# EAGLE design drucksensor (EAGLE 6.6.0)
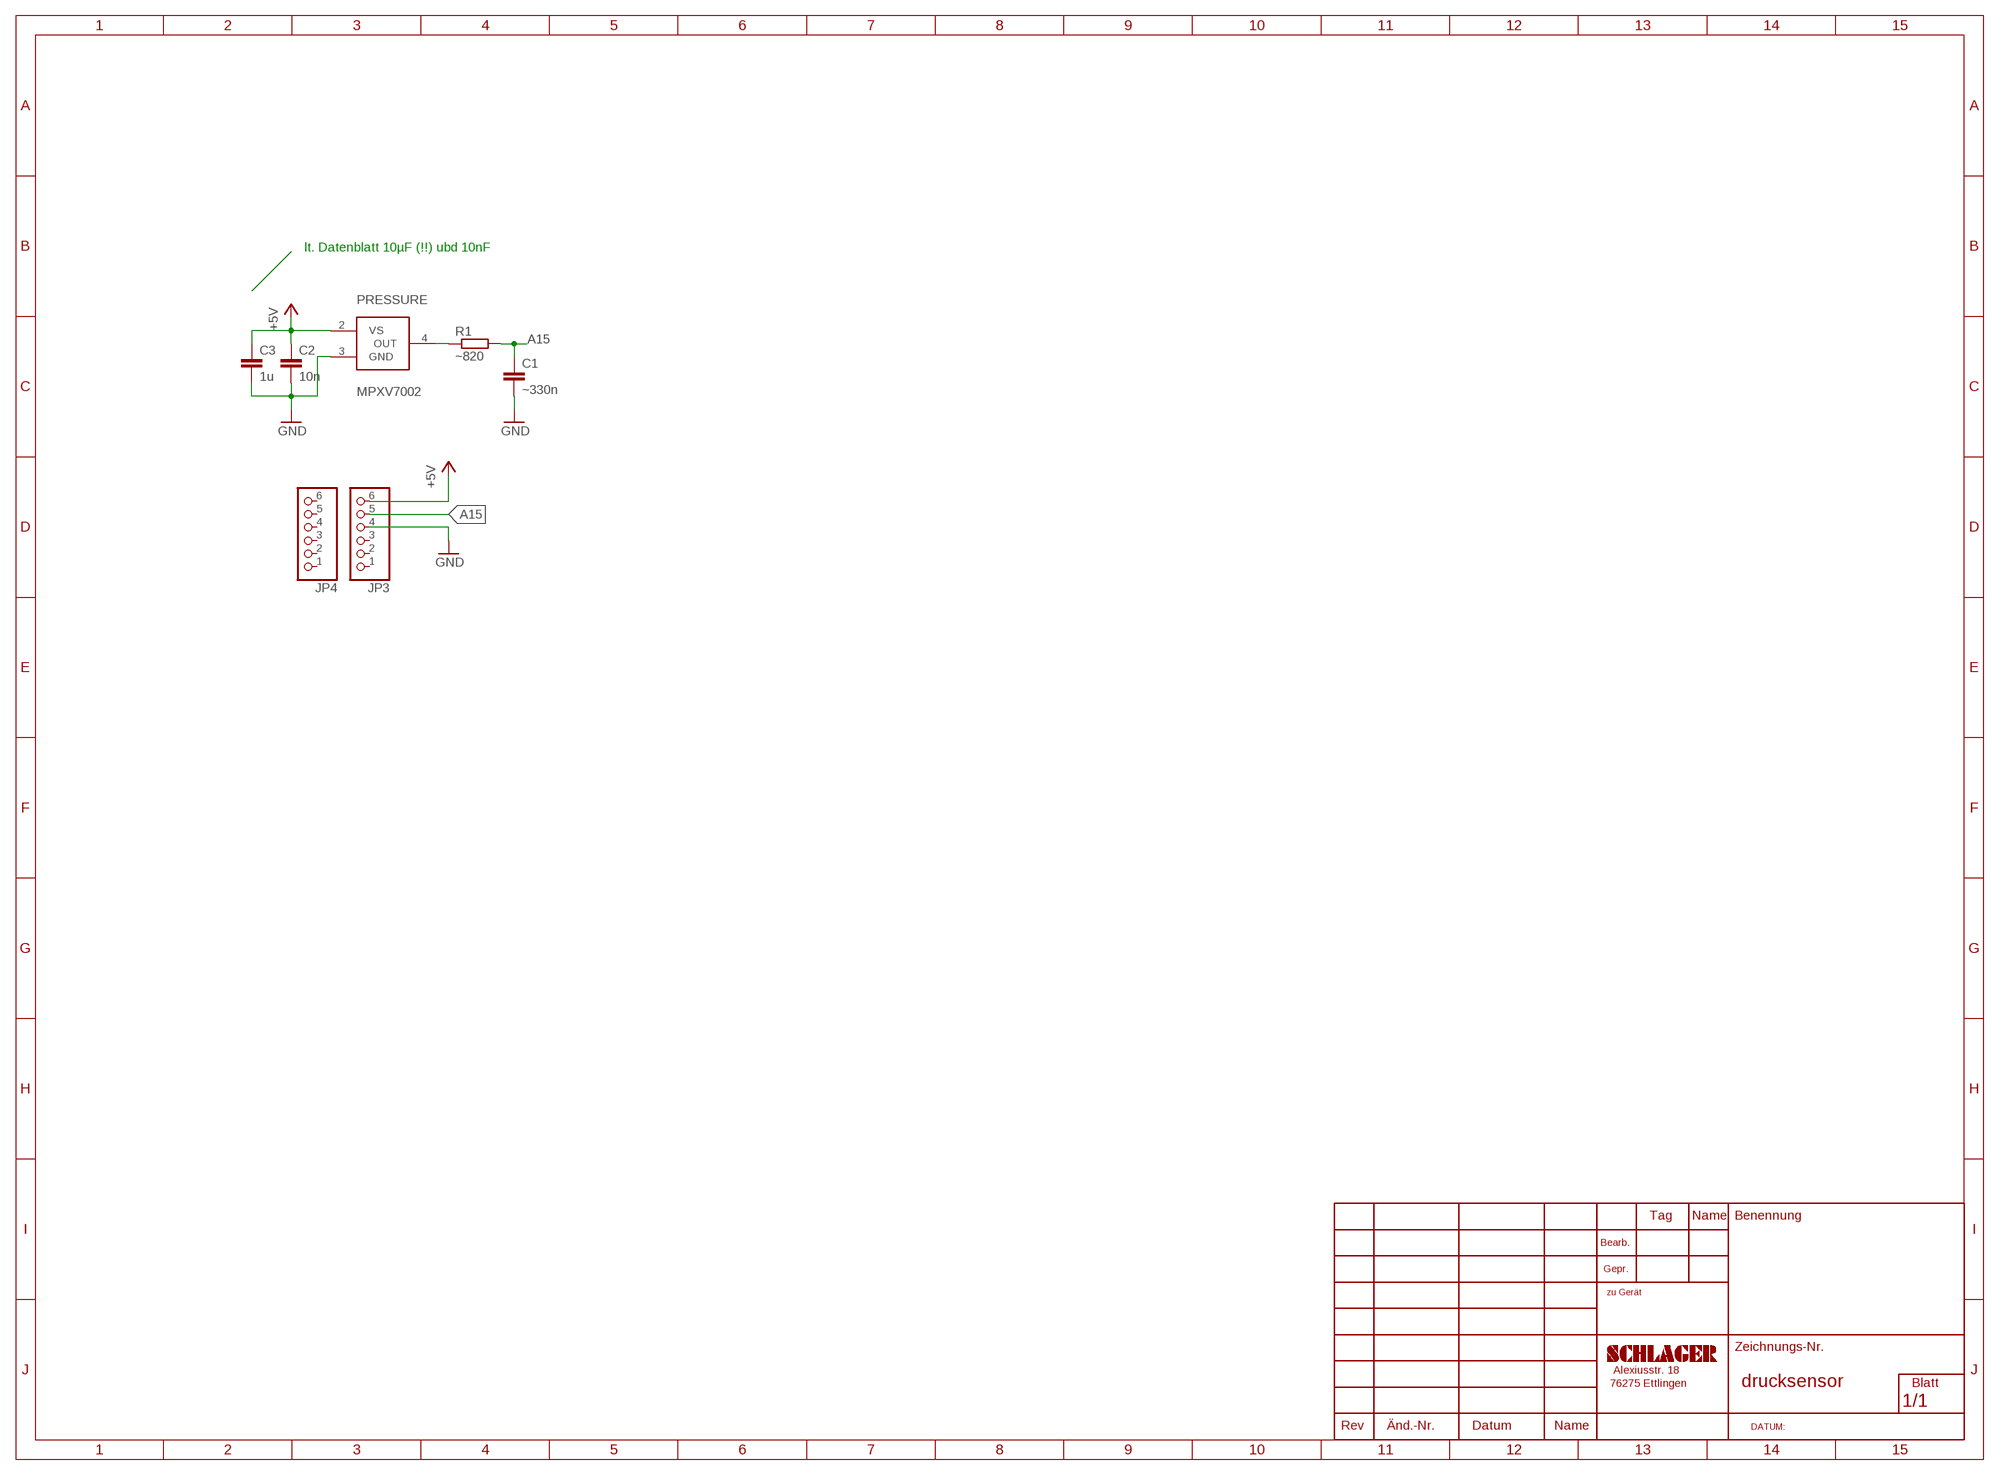
[diagram p0: schematic, sheet 1]

## Parts
C1  ~330n  C-EUC0805  [C0805]
C2  10n  C-EUC0805  [C0805]
C3  1u  C-EUC0805  [C0805]
JP3  PINHD-1X6  [1X06]
JP4  PINHD-1X6  [1X06]
PRESSURE  MPXV7002  [MPXV7002DP]
R1  ~820  R-EU_R0805  [R0805]

## Nets
+5V: C2.1 C3.1 JP3.6 PRESSURE.2(VS)
A15: C1.1 JP3.5 R1.2
GND: C1.2 C2.2 C3.2 JP3.4 PRESSURE.3(GND)
N$10: PRESSURE.4(OUT) R1.1
Unconnected: JP3.1 JP3.2 JP3.3 JP4.1 JP4.2 JP4.3 JP4.4 JP4.5 JP4.6

## Notes on the sheet
- lt. Datenblatt 10µF (!!) ubd 10nF

## Library data of the parts
C1-C3 = rcl:C-EU: CAPACITOR, European symbol
JP3 JP4 = pinhead:PINHD-1X6: PIN HEADER
PRESSURE = pcaroli:MPXV7002
R1 = rcl:R-EU_: RESISTOR, European symbol

## Net classes
0 default: clearance 0.205 mm

## Board
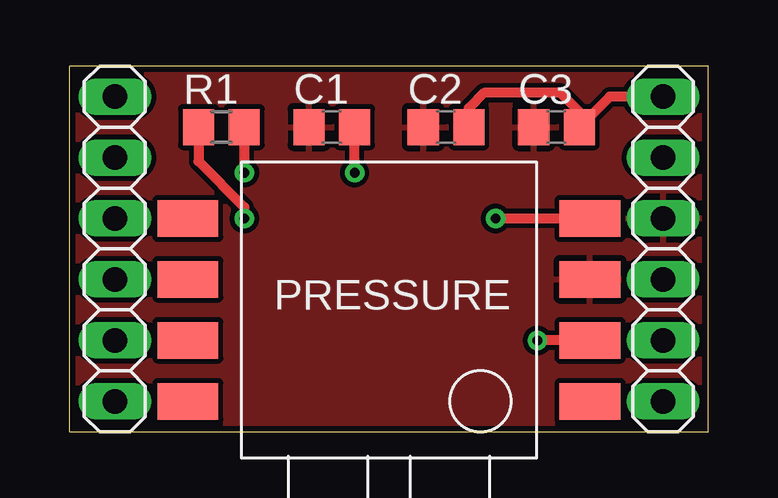
[diagram p1: board, top side]
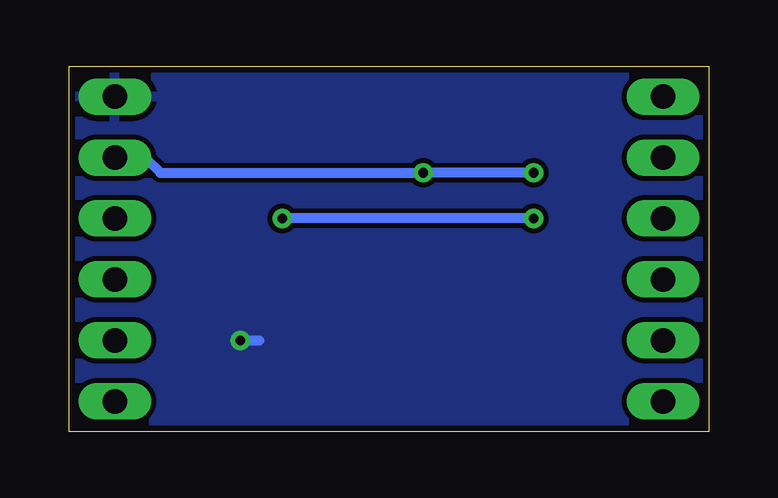
[diagram p2: board, bottom side, seen from below]

Size 26.66 x 15.23 mm. Coordinates in mm from the lower left corner, seen from the top.
Outline: 0,0 26.66,0 26.66,15.23 0,15.23 0,0
Copper layers (1*16): Top 0.035mm / dielectric 1.5mm / Bottom 0.035mm
Design rules "arduinoMega_ralf *": minimum track width 10mil, minimum drill 24mil, track to track 0.205mm, track to pad 0.205mm, pad to pad 0.205mm, via to via 0.205mm, smd to smd 8mil, copper to edge 10mil, drill to drill 8mil, minimum pad ring 10mil, minimum via ring 8mil, stop-mask expansion 4mil, vias tented up to drill 0mil, thermal gap 10mil

### Footprints (pad centres in the part's own frame; a part is rotated, then mirrored left to right if it is on the bottom)
C0805 = smd 1.3 x 1.5: 1 -0.95,0; 2 0.95,0
1X06 = drill 1.016 long: 1 -6.35,0; 2 -3.81,0; 3 -1.27,0; 4 1.27,0; 5 3.81,0; 6 6.35,0
MPXV7002DP = smd 2.54 x 1.524: 1 -8.382,3.81; 2 -8.382,1.27; 3 -8.382,-1.27; 4 -8.382,-3.81; 5 8.382,-3.81; 6 8.382,-1.27; 7 8.382,1.27; 8 8.382,3.81
R0805 = smd 1.3 x 1.5: 1 -0.95,0; 2 0.95,0

### Placement (x,y rotation side)
C1  10.95,12.7 180 top
C2  15.72,12.7 180 top
C3  20.32,12.7 180 top
JP3  24.77,7.62 90 top
JP4  1.91,7.62 90 top
PRESSURE  13.34,5.08 180 top
R1  6.35,12.7 0 top

### Tracks (layer width: path | path; a pad name or v marks a point on that pad's centre or on a via)
+5V  (via drill 0.4)
  Top 0.406: JP3.6 22.54,13.97 C3.1 21.27,13.34 20.48,14.13 17.3,14.13 16.67,13.49 C2.1 | PRESSURE.2 v19.53,3.81
  Bottom 0.406: v19.53,3.81 18.73,3.81
  pour Bottom: -2.54,21.59 35.56,21.59 35.56,-3.81 -2.54,-3.81
A15  (via drill 0.4)
  Top 0.406: v11.91,10.79 C1.1 | R1.2 v7.3,10.8 v7.3,10.79
  Bottom 0.406: JP3.5 23.5,11.43 22.86,10.79 v11.91,10.79 v7.3,10.79
GND
  pour Top: -6.35,32.7 46.04,32.7 46.04,-12.7 -6.35,-12.7
N$10  (via drill 0.4)
  Top 0.406: R1.1 5.4,11.27 7.3,9.37 v7.3,8.89 | v17.78,8.89 PRESSURE.4
  Bottom 0.406: v7.3,8.89 v17.78,8.89